# EAGLE schematic WeddingWidget (EAGLE 6.3)
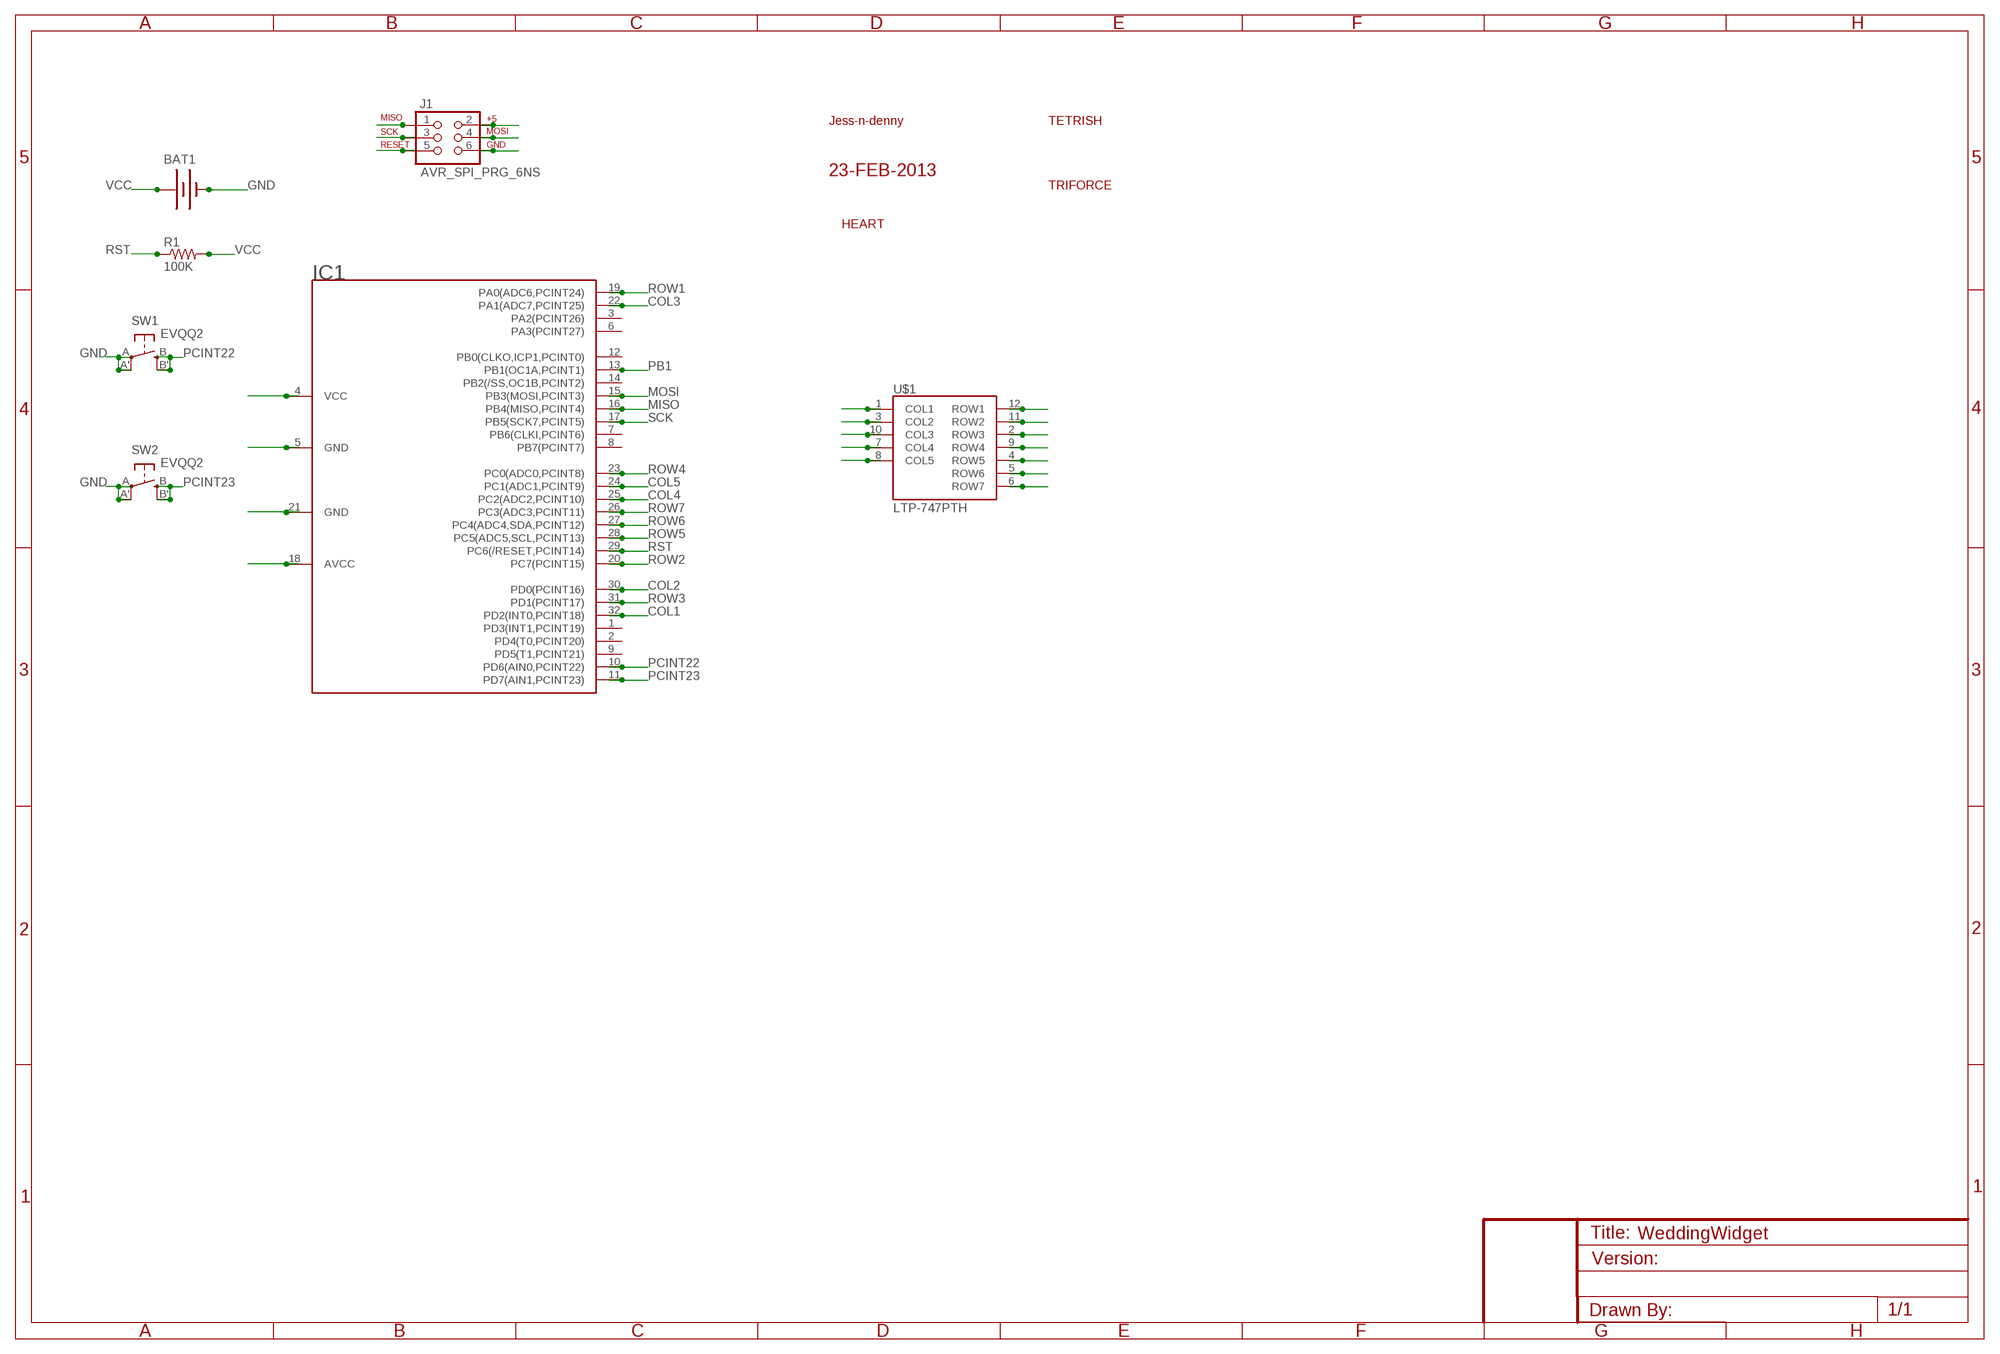
[diagram p0: schematic, sheet 1]

## Parts
BAT1  BATTERY12MM  [BATTCON_12MM]
IC1  ATTINY88  [TQFP32-08]
J1  AVR_SPI_PRG_6NS  [2X3-NS]
R1  100K  R-US_M0805  [M0805]
SW1  EVQQ2  [EVQ-Q2]
SW2  EVQQ2  [EVQ-Q2]
U$1  LTP-747PTH  [LTP-747]
U$2  JESS-N-DENNY  [JESS-N-DENNY]
U$3  23FEB2013  [23FEB2013]
U$4  HEART  [HEART]
U$5  TETRISH  [TETRISH]
U$6  TRIFORCE  [TRIFORCE]

## Nets
COL1: IC1.32(PD2(INT0,PCINT18)) U$1.1(COL1)
COL2: IC1.30(PD0(PCINT16)) U$1.3(COL2)
COL3: IC1.22(PA1(ADC7,PCINT25)) U$1.10(COL3)
COL4: IC1.25(PC2(ADC2,PCINT10)) U$1.7(COL4)
COL5: IC1.24(PC1(ADC1,PCINT9)) U$1.8(COL5)
GND: BAT1.GND(-) IC1.5(GND) IC1.21(GND) J1.6 SW1.A'(P1) SW1.A(P) SW2.A'(P1) SW2.A(P)
MISO: IC1.16(PB4(MISO,PCINT4)) J1.1
MOSI: IC1.15(PB3(MOSI,PCINT3)) J1.4
PB1: IC1.13(PB1(OC1A,PCINT1))
PCINT22: IC1.10(PD6(AIN0,PCINT22)) SW1.B'(S1) SW1.B(S)
PCINT23: IC1.11(PD7(AIN1,PCINT23)) SW2.B'(S1) SW2.B(S)
ROW1: IC1.19(PA0(ADC6,PCINT24)) U$1.12(ROW1)
ROW2: IC1.20(PC7(PCINT15)) U$1.11(ROW2)
ROW3: IC1.31(PD1(PCINT17)) U$1.2(ROW3)
ROW4: IC1.23(PC0(ADC0,PCINT8)) U$1.9(ROW4)
ROW5: IC1.28(PC5(ADC5,SCL,PCINT13)) U$1.4(ROW5)
ROW6: IC1.27(PC4(ADC4,SDA,PCINT12)) U$1.5(ROW6)
ROW7: IC1.26(PC3(ADC3,PCINT11)) U$1.6(ROW7)
RST: IC1.29(PC6(/RESET,PCINT14)) J1.5 R1.1
SCK: IC1.17(PB5(SCK7,PCINT5)) J1.3
VCC: BAT1.V+(+) IC1.4(VCC) IC1.18(AVCC) J1.2 R1.2
Unconnected: IC1.1(PD3(INT1,PCINT19)) IC1.2(PD4(T0,PCINT20)) IC1.3(PA2(PCINT26)) IC1.6(PA3(PCINT27)) IC1.7(PB6(CLKI,PCINT6)) IC1.8(PB7(PCINT7)) IC1.9(PD5(T1,PCINT21)) IC1.12(PB0(CLKO,ICP1,PCINT0)) IC1.14(PB2(/SS,OC1B,PCINT2))

## Library data of the parts
BAT1 = rxtx-labs:BATTERY: Battery Holders Various common sizes : AA, AAA, 20mm coin cell and 12mm coin cell.
IC1 = attiny88:ATTINY88
J1 = SparkFun:AVR_SPI_PRG_6: AVR ISP 6 Pin This is the reduced ISP connector for AVR programming. Common on Arduino. This footprint will take up less PCB space and can be used with a 10-pin to 6-pin adapter such as SKU: BOB-08508
R1 = adafruit:R-US_: RESISTOR, American symbol
SW1 SW2 = adafruit:EVQQ2: SMT 6mm switch, EVQQ2 series http://www.ladyada.net/library/eagle
U$1 = LiteOn-LED-Matrix:LTP-747: Jameco Part #2005454
U$2 = rxtx-labs:JESS-N-DENNY
U$3 = rxtx-labs:23FEB2013
U$4 = rxtx-labs:HEART
U$5 = rxtx-labs:TETRISH
U$6 = rxtx-labs:TRIFORCE